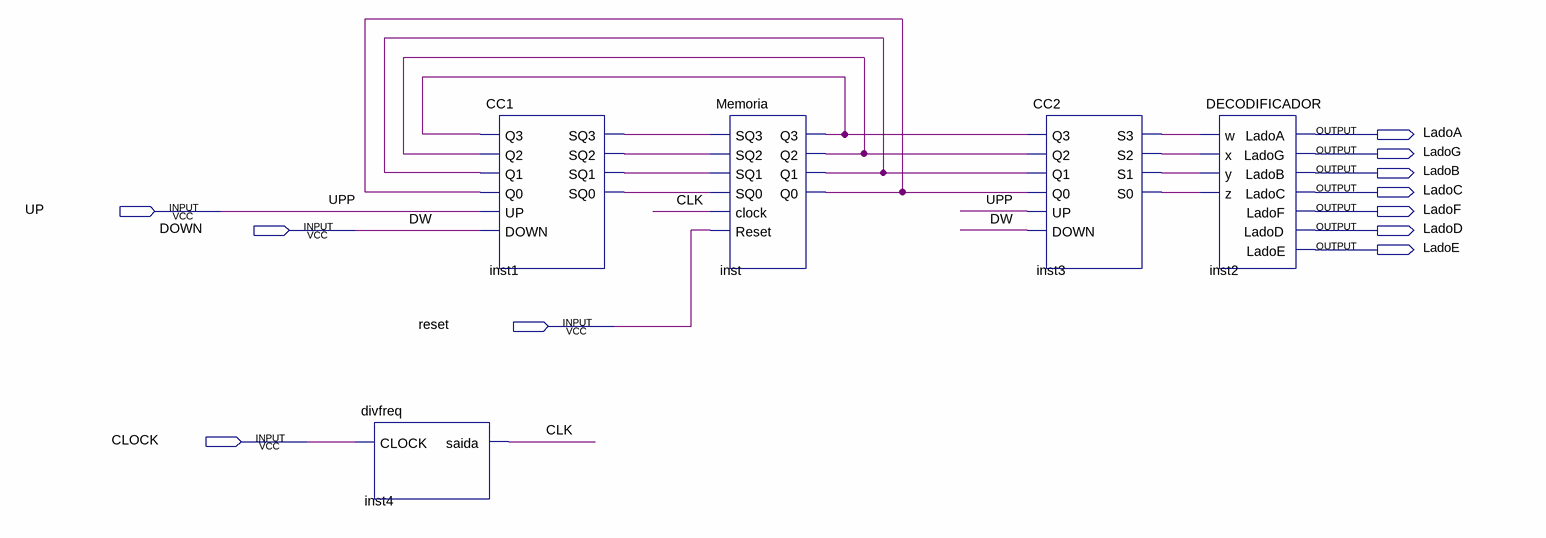
[diagram p0: schematic sheet]
// Quartus schematic Mealy.bdf as structural Verilog: 5 symbols, 11 pins
module Mealy (
  input  UP,
  input  DOWN,
  input  reset,
  input  CLOCK,
  output LadoA,
  output LadoG,
  output LadoB,
  output LadoC,
  output LadoF,
  output LadoD,
  output LadoE
);

  wire CLK, inst1_sq0, inst1_sq1, inst1_sq2, inst1_sq3, inst3_s0, inst3_s1, inst3_s2, inst3_s3, inst_q0,
       inst_q1, inst_q2, inst_q3;

  divfreq inst4 (.CLOCK(CLOCK), .saida(CLK));
  CC1 inst1 (
    .Q3(inst_q3), .Q2(inst_q2), .Q1(inst_q1), .Q0(inst_q0), .UP(UP), .DOWN(DOWN), .SQ3(inst1_sq3),
    .SQ2(inst1_sq2), .SQ1(inst1_sq1), .SQ0(inst1_sq0));
  Memoria inst (
    .SQ3(inst1_sq3), .SQ2(inst1_sq2), .SQ1(inst1_sq1), .SQ0(inst1_sq0), .clock(CLK), .Reset(reset),
    .Q3(inst_q3), .Q2(inst_q2), .Q1(inst_q1), .Q0(inst_q0));
  CC2 inst3 (
    .Q3(inst_q3), .Q2(inst_q2), .Q1(inst_q1), .Q0(inst_q0), .UP(UP), .DOWN(DOWN), .S3(inst3_s3),
    .S2(inst3_s2), .S1(inst3_s1), .S0(inst3_s0));
  DECODIFICADOR inst2 (
    .w(inst3_s3), .x(inst3_s2), .y(inst3_s1), .z(inst3_s0), .LadoA(LadoA), .LadoG(LadoG), .LadoB(LadoB),
    .LadoC(LadoC), .LadoF(LadoF), .LadoD(LadoD), .LadoE(LadoE));

  // Other names for the same wires on the sheet: DW = DOWN; UPP = UP
endmodule
